# EAGLE design tm8_racingStripes (EAGLE 9.6.2)
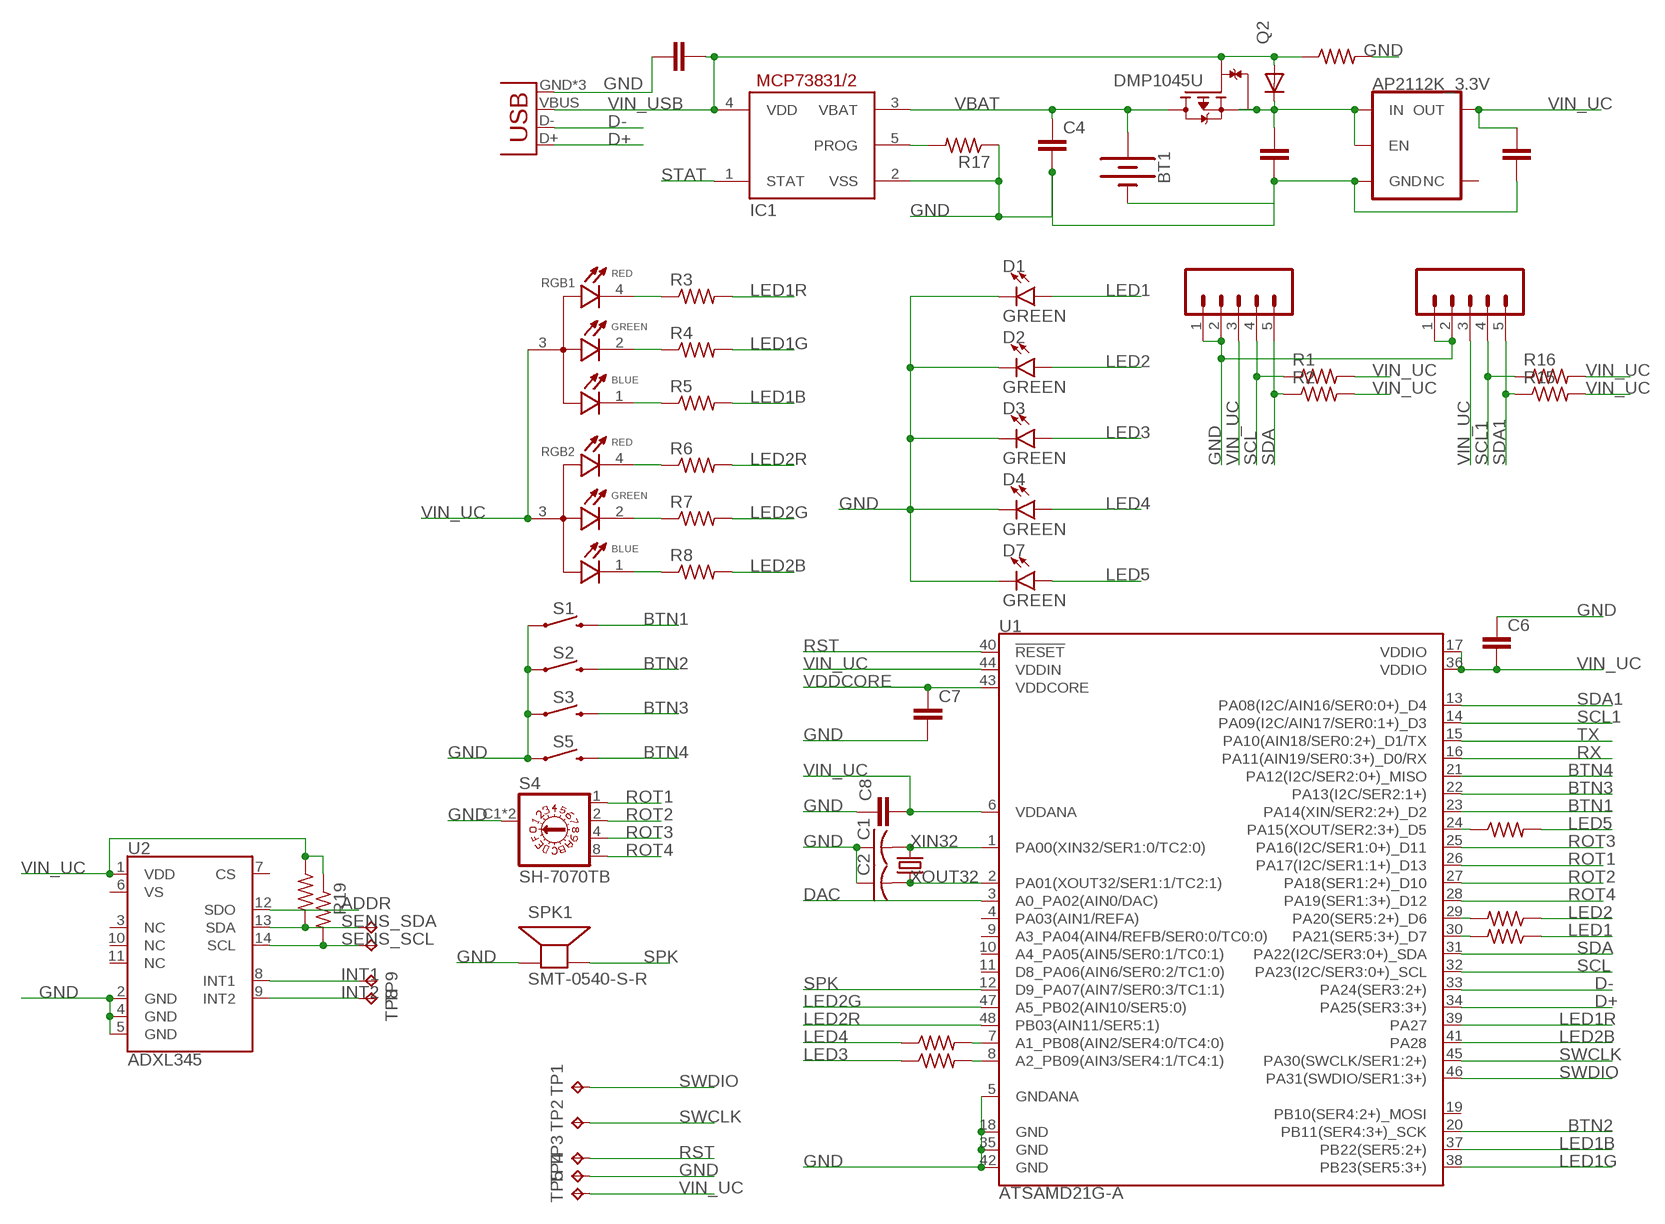
[diagram p0: schematic, sheet 1]

## Parts
AP2112K_3.3V  3.3V  V_REG_AP2112K-3.3V  [SOT23-5]
BT1  BATTERY-20MM_SMD_4LEGS_OVERPASTE_INNER  [BATTCON_20MM_4LEGS_OVERPASTE_INNER]
C1  C-USC0603  [C0603]
C2  C-USC0603  [C0603]
C3  C-EUC0603  [C0603]
C4  C-EUC0603  [C0603]
C5  C-EUC0603  [C0603]
C6  C-EUC0603  [C0603]
C7  C-EUC0603  [C0603]
C8  C-EUC0603  [C0603]
C9  C-EUC0603  [C0603]
D1  GREEN  LED-GREEN1206  [LED-1206]
D2  GREEN  LED-GREEN1206  [LED-1206]
D3  GREEN  LED-GREEN1206  [LED-1206]
D4  GREEN  LED-GREEN1206  [LED-1206]
D7  GREEN  LED-GREEN1206  [LED-1206]
D8  DIODESOD-323F  [SOD-323F]
IC1  MCP73831/OT  [SOT23-5L]
JP2  USB-MICROB  [USB-MICROB]
LCD1  CONN_05VERT_FEMALE_HEADER  [1X05_SMD_VERTICAL_COMBO]
LCD2  CONN_05VERT_FEMALE_HEADER  [1X05_SMD_VERTICAL_COMBO]
Q2  DMP1045U  [SOT91P240X110-3N]
R1  R-US_R0603  [R0603]
R2  R-US_R0603  [R0603]
R3  R-US_R0603  [R0603]
R4  R-US_R0603  [R0603]
R5  R-US_R0603  [R0603]
R6  R-US_R0603  [R0603]
R7  R-US_R0603  [R0603]
R8  R-US_R0603  [R0603]
R9  R-US_R0603  [R0603]
R10  R-US_R0603  [R0603]
R11  R-US_R0603  [R0603]
R12  R-US_R0603  [R0603]
R13  R-US_R0603  [R0603]
R14  R-US_R0603  [R0603]
R15  R-US_R0603  [R0603]
R16  R-US_R0603  [R0603]
R17  R-US_R0603  [R0603]
R18  R-US_R0603  [R0603]
R19  R-US_R0603  [R0603]
RGB1  EAST1616RGBA3  [LED_EAST1616RGBA3]
RGB2  EAST1616RGBA3  [LED_EAST1616RGBA3]
S1  MOMENTARY-SWITCH-SPST-SMD-6.0X3.5MM  [TACTILE_SWITCH_SMD_6.0X3.5MM]
S2  MOMENTARY-SWITCH-SPST-SMD-6.0X3.5MM  [TACTILE_SWITCH_SMD_6.0X3.5MM]
S3  MOMENTARY-SWITCH-SPST-SMD-6.0X3.5MM  [TACTILE_SWITCH_SMD_6.0X3.5MM]
S4  SH-7070TB  [SH-7070B]
S5  MOMENTARY-SWITCH-SPST-SMD-6.0X3.5MM  [TACTILE_SWITCH_SMD_6.0X3.5MM]
SPK1  SMT-0540-S-R  [SMT-0540-S-R]
TP1  TPTP10R  [TP10R]
TP2  TPTP10R  [TP10R]
TP3  TPTP10R  [TP10R]
TP4  TPTP10R  [TP10R]
TP5  TPTP10R  [TP10R]
TP6  TPTP10R  [TP10R]
TP7  TPTP10R  [TP10R]
TP8  TPTP10R  [TP10R]
TP9  TPTP10R  [TP10R]
U1  ATSAMD21G-A  [TQFP-48]
U2  ADXL345  [LGA-14]
Y1  32.768kHz  CRYSTAL-32.768KHZSMD-3.2X1.5  [CRYSTAL-SMD-3.2X1.5MM]

## Nets
ADDR: U2.12(SDO)
BTN1: S1.2 U1.23(PA14(XIN/SER2:2+)_D2)
BTN2: S2.2 U1.20(PB11(SER4:3+)_SCK)
BTN3: S3.2 U1.22(PA13(I2C/SER2:1+))
BTN4: S5.2 U1.21(PA12(I2C/SER2:0+)_MISO)
D+: JP2.D+ U1.34(PA25(SER3:3+))
D-: JP2.D- U1.33(PA24(SER3:2+))
DAC: U1.3(A0_PA02(AIN0/DAC))
GND: AP2112K_3.3V.2(GND) BT1.2(-) C1.1 C2.1 C3.1 C4.2 C5.2 C6.1 C7.2 C8.1 C9.2 D1.C D2.C D3.C D4.C D7.C IC1.2(VSS) JP2.GND JP2.MT1(GND) JP2.MT2(GND) LCD1.1 LCD1.2 LCD2.1 LCD2.2 R14.2 R17.1 S1.1 S2.1 S3.1 S4.C1(C) S4.C2(C) S5.1 SPK1.-(+) TP4.TP U1.5(GNDANA) U1.18(GND) U1.35(GND) U1.42(GND) U2.2(GND) U2.4(GND) U2.5(GND)
INT1: TP9.TP U2.8(INT1)
INT2: TP8.TP U2.9(INT2)
LED1: D1.A R9.1
LED1B: R5.2 U1.37(PB22(SER5:2+))
LED1G: R4.2 U1.38(PB23(SER5:3+))
LED1R: R3.2 U1.39(PA27)
LED2: D2.A R10.1
LED2B: R8.2 U1.41(PA28)
LED2G: R7.2 U1.47(A5_PB02(AIN10/SER5:0))
LED2R: R6.2 U1.48(PB03(AIN11/SER5:1))
LED3: D3.A R11.1
LED4: D4.A R12.1
LED5: D7.A R13.2
N$1: R12.2 U1.7(A1_PB08(AIN2/SER4:0/TC4:0))
N$2: R11.2 U1.8(A2_PB09(AIN3/SER4:1/TC4:1))
N$3: R9.2 U1.30(PA21(SER5:3+)_D7)
N$4: R10.2 U1.29(PA20(SER5:2+)_D6)
N$5: R3.1 RGB1.4(R_C)
N$6: R4.1 RGB1.2(G_C)
N$7: R5.1 RGB1.1(B_C)
N$8: R6.1 RGB2.4(R_C)
N$9: R7.1 RGB2.2(G_C)
N$10: R8.1 RGB2.1(B_C)
N$11: R13.1 U1.24(PA15(XOUT/SER2:3+)_D5)
N$13: IC1.5(PROG) R17.2
ROT1: S4.1 U1.26(PA17(I2C/SER1:1+)_D13)
ROT2: S4.2 U1.27(PA18(SER1:2+)_D10)
ROT3: S4.4 U1.25(PA16(I2C/SER1:0+)_D11)
ROT4: S4.8 U1.28(PA19(SER1:3+)_D12)
RST: TP3.TP U1.40(!RESET!)
RX: U1.16(PA11(AIN19/SER0:3+)_D0/RX)
SCL: LCD1.4 R1.1 U1.32(PA23(I2C/SER3:0+)_SCL)
SCL1: LCD2.4 R16.1 U1.14(PA09(I2C/AIN17/SER0:1+)_D3)
SDA: LCD1.5 R2.1 U1.31(PA22(I2C/SER3:0+)_SDA)
SDA1: LCD2.5 R15.1 U1.13(PA08(I2C/AIN16/SER0:0+)_D4)
SENS_SCL: R19.2 TP6.TP U2.14(SCL)
SENS_SDA: R18.2 TP7.TP U2.13(SDA)
SPK: SPK1.+(-) U1.12(D9_PA07(AIN7/SER0:3/TC1:1))
STAT: IC1.1(STAT)
SWCLK: TP2.TP U1.45(PA30(SWCLK/SER1:2+))
SWDIO: TP1.TP U1.46(PA31(SWDIO/SER1:3+))
TX: U1.15(PA10(AIN18/SER0:2+)_D1/TX)
VBAT: BT1.1(+) C4.1 IC1.3(VBAT) Q2.3(D)
VDDCORE: C7.1 U1.43(VDDCORE)
VIN_UC: AP2112K_3.3V.5(OUT) C5.1 C6.2 C8.2 LCD1.3 LCD2.3 R1.2 R2.2 R15.2 R16.2 R18.1 R19.1 RGB1.3(A) RGB2.3(A) TP5.TP U1.6(VDDANA) U1.17(VDDIO) U1.36(VDDIO) U1.44(VDDIN) U2.1(VDD)
VIN_UC_RAW: AP2112K_3.3V.1(IN) AP2112K_3.3V.3(EN) C9.1 D8.C Q2.2(S)
VIN_USB: C3.2 D8.A IC1.4(VDD) JP2.VBUS Q2.1(G) R14.1
XIN32: C1.2 U1.1(PA00(XIN32/SER1:0/TC2:0)) Y1.P$2
XOUT32: C2.2 U1.2(PA01(XOUT32/SER1:1/TC2:1)) Y1.P$1
Unconnected: AP2112K_3.3V.4(NC) U1.4(PA03(AIN1/REFA)) U1.9(A3_PA04(AIN4/REFB/SER0:0/TC0:0)) U1.10(A4_PA05(AIN5/SER0:1/TC0:1)) U1.11(D8_PA06(AIN6/SER0:2/TC1:0)) U1.19(PB10(SER4:2+)_MOSI) U2.3(NC) U2.6(VS) U2.7(CS) U2.10(NC) U2.11(NC)

## Library data of the parts
AP2112K_3.3V = SparkFun-IC-Power:V_REG_AP2112: AP2112 - 600mA CMOS LDO Regulator w/ Enable The AP2112 is CMOS process low dropout linear regulator with enable function, the regulator delivers a guaranteed 600mA (min.) continuous load current. Features Output Voltage Accuracy: ±1.5% Output Current: 600mA (Min.) Foldback Short Current Protection: 50mA Enable Function to Turn ON/OFF VOUT Low Dropout Voltage (3.3V): 250mV (Typ.) @IOUT=600mA Excellent Load Regulation: 0.2%/A (Typ.) Excellent Line Regulation: 0.02%/V (Typ.) Low Quiescent Current: 55μA (Typ.) Low Standby Current: 0.01μA (Typ.) Low Output Noise: 50μVRMS PSRR: 100Hz -65dB, 1kHz -65dB OTSD Protection Stable with 1.0μF Flexible Cap: Ceramic, Tantalum and Aluminum Electrolytic Operation Temperature Range: -40°C to 85°C ESD: MM 400V, HBM 4000V; PROD_ID: VREG-12457
BT1 = SparkFun-Batteries:BATTERY: Battery - Single Cell A variety of battery chemistries, sizes, and footprints. Device List: 20MM_PTH - Coin Cell Battery Holder - 20mm (PTH) <https://www.sparkfun.com/products/783> 20MM_PTH_KIT- Coin Cell battery Holder - 20 mm (PTH) <http://www.sparkfun.com/products/783>kit version with special mask 6.8MM_PTH - Coin Cell Battery Holder - 6.8MM(SMD) <https://www.digikey.com/product-detail/en/seiko-instruments/MS621FE-FL11E/728-1057-ND/1889208?WT.srch=1&gclid=CNOQ5a6LzdQCFZS2wAodXCkE0g> 12MM_SMD - Coin Cell Battery Holder - 12mm (SMD) <https://www.sparkfun.com/products/10592> 12MM_PTH - Coin Cell Battery Holder - 12mm (PTH) <https://www.sparkfun.com/products/7948> 20MM_SMD - 20mm Coin Cell Battery Holder (SMD) (2 legs) Used on the Big Time Watch Kit <https://www.sparkfun.com/products/11734> 20MM_SMD_4LEGS - Coin Cell Battery Holder - 20mm (SMD) <https://www.sparkfun.com/products/11892> 20MM_SMD_4LEGS_OVERPASTE - Coin Cell Battery Holder - 20mm (SMD) <https://www.sparkfun.com/products/11892> (Over-paste on the legs) 24.5MM_PTH - Coin Cell Battery Holder - 24.5mm (PTH) <https://www.sparkfun.com/products/8863> 9V - 9V Battery Holder - PC Mount Used on the SparkFun SparkPunk Sound Kit <https://www.sparkfun.com/products/11177> and SparkFun SparkPunk Sequencer Kit <https://www.sparkfun.com/products/12707> 18650 - Battery Holder - 18650 (PTH) <https://www.sparkfun.com/products/13113> AA - Battery Holder - 1xAA (PTH) <https://www.sparkfun.com/products/7949> AAA - Battery Holder - 1xAAA (PTH) <https://www.sparkfun.com/products/12718> AA_KIT - Battery Holder - 1xAA (PTH) <https://www.sparkfun.com/products/7949> Special kit package - pads only have exposed copper on one side of the board. AAA_KIT - Battery Holder - 1xAAA (PTH) <https://www.sparkfun.com/products/12718> Special kit package - pads only have exposed copper on one side of the board.
C1 C2 = adafruit:C-US: CAPACITOR, American symbol
C3-C9 = rcl:C-EU: CAPACITOR, European symbol; SPICEPREFIX: C
D1-D4 D7 = SparkFun-LED:LED-GREEN: Green SMD LED Used in manufacturing of various products at SparkFun Packages: 0603 - SMD 0603 package [Product Link] <http://www.futureelectronics.com/en/technologies/semiconductors/optoelectronics/leds/Pages/9894312-LTST-C190GKT.aspx?CrossPart=HSMG-C190&IM=0> LilyPad 1206 - SMD1206 LilyPad package [Product Link] <http://www.futureelectronics.com/en/Technologies/Product.aspx?ProductID=IN150NGHARVATEKCORPORATION2049943&IM=0> 1206 - SMD1206 package [Product Link] <http://www.futureelectronics.com/en/technologies/semiconductors/optoelectronics/leds/Pages/8315665-LTST-C150KGKT.aspx?IM=0> 1206 Bottom Mount -SMD 1206 Bottom Mount [Product Link] <http://www.digikey.com/product-detail/en/lite-on-inc/LTST-C230KGKT/160-1456-1-ND/386854> SparkFun Products: Pro Mini 328 -5V <https://www.sparkfun.com/products/821> RedBoard <https://www.sparkfun.com/products/12757> MP3 Trigger <https://www.sparkfun.com/products/13720> Makey Makey <https://www.sparkfun.com/products/11076>; PROD_ID: DIO-00862
D8 = adafruit:DIODE: Diode SMADIODE - SMA Surface Mount Package 20V 1A Schottky Diode Digikey: 641-1014-6-ND DO-1N4148 - Through Hole Small Current Diode SOD-123 20V 1 A (.5mV Vf) Schottky Diode - Digikey: MBRX120TPMSCT-ND SOD-323 10V 570mA (.38mV Vf, 3ns) Schottky Diode - Digikey: ZLLS410CT-ND SOD-523 30V 30mA Schottky Diode (RB751S-40TE61) - Digikey: RB751S-40TE61CT-ND SOT23-R/W - SOT23 Package (R = Solder Paste/Reflow Ovens, W = Hand-Soldering) BAT54Film 40V 300mA - Digikey: 497-7162-1-ND
IC1 = adafruit:MCP73831: MCP73831/2 Miniature Single-Cell, Fully Integrated Li-Ion, Li-Polymer Charge Management Controllers. Nice and small simple lipoly charge controller, with adjustable current and status output (LED) http://www.ladyada.net/library/pcb/eaglelibrary.html
JP2 = Feesta-parts:USB: USB Connectors USB-B-PTH is fully proven SKU : PRT-00139/CONN-08278 USB-miniB is fully proven SKU : PRT-00587 USB-A-PCB is untested. USB-A-H is throughly reviewed, but untested. Spark Fun Electronics SKU : PRT-00437 USB-B-SMT is throughly reviewed, but untested. Needs silkscreen touching up. USB-A-S has not been used/tested USB-MB-H has not been used/tested USB-MICROB has been used. CONN-09505; PROD_ID: CONN-09505
LCD1 LCD2 = SparkFun-Connectors:CONN_05: Multi connection point. Often used as Generic Header-pin footprint for 0.1 inch spaced/style header connections On any of the 0.1 inch spaced packages, you can populate with these: Break Away Headers - Straight <https://www.sparkfun.com/products/116> (PRT-00116) Break Away Male Headers - Right Angle <https://www.sparkfun.com/products/553> (PRT-00553) Female Headers <https://www.sparkfun.com/products/115> (PRT-00115) Break Away Headers - Machine Pin <https://www.sparkfun.com/products/117> (PRT-00117) Break Away Female Headers - Swiss Machine Pin <https://www.sparkfun.com/products/743> (PRT-00743) For SCREWTERMINALS and SPRING TERMINALS visit here: Screw Terimnals on SparkFun.com <https://www.sparkfun.com/search/results?term=Screw+Terminals> (5mm/3.5mm/2.54mm spacing) This device is also useful as a general connection point to wire up your design to another part of your project. Our various solder wires solder well into these plated through hole pads. Hook-Up Wire - Assortment (Stranded, 22 AWG) <https://www.sparkfun.com/products/11375> (PRT-11375) Hook-Up Wire - Assortment (Solid Core, 22 AWG) <https://www.sparkfun.com/products/11367> (PRT-11367) View the entire wire category on our website here <https://www.sparkfun.com/categories/141> Special notes: Molex polarized connector foot print use with SKU : PRT-08231 with associated crimp pins and housings. 1MM SMD Version SKU: PRT-10208; PROD_ID: CONN-15262
Q2 = DMP1045U:DMP1045U: P-Channel 12V 4A (Ta) 800mW (Ta) Surface Mount SOT-23 Check availability <https://pricing.snapeda.com/parts/DMP1045U/Diodes%20Inc./view-part?ref=eda>; AVAILABILITY: In Stock; DESCRIPTION: P-Channel 12 V 2.6A (Ta) 530mW Surface Mount X2-WLB0808-4 (Type C); MF: Diodes Inc.; MP: DMP1045U; PACKAGE: SOT-23 Diodes Inc.; PRICE: None; PURCHASE-URL: https://pricing.snapeda.com/search/part/DMP1045U/?ref=eda
R1-R13 R15 R16 R18 R19 = rcl:R-US_: RESISTOR, American symbol; SPICEPREFIX: R
R14 R17 = adafruit:R-US_: RESISTOR, American symbol
RGB1 RGB2 = EAST1616RGBA3:EAST1616RGBA3: Red, Green, Blue (RGB) LED Indication - Discrete 1.95V Red, 2.8V Green, 2.8V Blue 0606 (1616 Metric) Check availability <https://pricing.snapeda.com/parts/EAST1616RGBA3/Everlight%20Electronics/view-part?ref=eda>; AVAILABILITY: In Stock; DESCRIPTION: Red, Green, Blue (RGB) - LED Indication - Discrete 1.95V Red, 2.8V Green, 2.8V Blue 0606 (1616 Metric); MF: Everlight Electronics; MP: EAST1616RGBA3; PACKAGE: 0606 Everlight; PRICE: None; PURCHASE-URL: https://pricing.snapeda.com/search/part/EAST1616RGBA3/?ref=eda
S1-S3 S5 = SparkFun-Switches:MOMENTARY-SWITCH-SPST: Momentary Switch (Pushbutton) - SPST Normally-open (NO) SPST momentary switches (buttons, pushbuttons). Variants PTH-12MM - 12mm square, through-hole Momentary Pushbutton Switch - 12mm Square <https://www.sparkfun.com/products/9190> (COM-09190) PTH-6.0MM, PTH-6.0MM-KIT - 6.0mm square, through-hole Mini Pushbutton Switch <https://www.sparkfun.com/products/97> (COM-00097) KIT package intended for soldering kit's - only one side of pads' copper is exposed. PTH-RIGHT-ANGLE-KIT - Right-angle, through-hole Right Angle Tactile Button <https://www.sparkfun.com/products/10791> - Used on SparkFun BigTime Watch Kit <https://www.sparkfun.com/products/11734> SMD-12MM - 12mm square, surface-mount Tactile Button - SMD (12mm) <https://www.sparkfun.com/products/12993> (COM-12993) Used on SparkFun PicoBoard <https://www.sparkfun.com/products/11888> SMD-4.5MM - 4.5mm Square Trackball Switch Used on SparkFun Blackberry Trackballer Breakout <https://www.sparkfun.com/products/13169> SMD-4.6MMX2.8MM - 4.60mm x 2.80mm, surface mount Used on SparkFun Pro Micro - RP2040 <https://www.sparkfun.com/products/17717> SMD-5.2MM, SMD-5.2-REDUNDANT - 5.2mm square, surface-mount Mini Pushbutton Switch - SMD <https://www.sparkfun.com/products/8720> (COM-08720) Used on Arduino Pro Mini <https://www.sparkfun.com/products/11114> REDUNDANT package connects both switch circuits together SMD-6.0X3.5MM - 6.0 x 3.5mm, surface mount Momentary Reset Switch SMD <https://www.sparkfun.com/products/8229> (COM-08229) SMD-6.2MM-TALL - 6.2mm square, surface mount Tactile Button - SMD (6mm) <https://www.sparkfun.com/products/12992> Used on SparkFun Digital Sandbox <https://www.sparkfun.com/products/12651> SMD-RIGHT-ANGLE - Right-angle, surface mount Used on SparkFun Block for Intel® Edison - Arduino <https://www.sparkfun.com/products/13036>; PROD_ID: SWCH-14278; SF_SKU: COM-08229
S4 = SH-7070TB:SH-7070TB: ROTARY CODED HEX SWITCH Check availability <https://pricing.snapeda.com/parts/SH-7070TB/Nidec%20Copal/view-part?ref=eda>; AVAILABILITY: In Stock; DESCRIPTION: Dip Switch Hexadecimal Complement 16 Position Surface Mount Rotary for Tool Actuator 100mA 5VDC; MF: Nidec Copal; MP: SH-7070TB; PACKAGE: None; PRICE: None; PURCHASE-URL: https://pricing.snapeda.com/search/part/SH-7070TB/?ref=eda
SPK1 = SMT-0540-S-R:SMT-0540-S-R: SMT-0549-S-R Small surface-mount magnetic buzzer Check availability <https://pricing.snapeda.com/parts/SMT-0540-S-R/PUI/view-part?ref=eda>; AVAILABILITY: In Stock; DESCRIPTION: SURFACE MOUNT TRANSDUCER 3V0-P 100MA; MF: PUI; MP: SMT-0540-S-R; PACKAGE: None; PRICE: None; PURCHASE-URL: https://pricing.snapeda.com/search/part/SMT-0540-S-R/?ref=eda
TP1-TP9 = testpad:TP: Test pad
U1 = SparkFun-IC-Microcontroller:ATSAMD21G: Atmel SAMD21G SMART ARM-Based Microcontroller The Atmel ® | SMART ™ SAM D21 is a series of low-power microcontrollers using the 32-bit ARM ® Cortex ® -M0+ processor, and ranging from 32- to 64-pins with up to 256KB Flash and 32KB of SRAM. The SAM D21 devices operate at a maximum frequency of 48MHz and reach 2.46 CoreMark/MHz. They are designed for simple and intuitive migration with identical peripheral modules, hex compatible code, identical linear address map and pin compatible migration paths between all devices in the product series. All devices include intelligent and flexible peripherals, Atmel Event System for inter-peripheral signaling, and support for capacitive touch button, slider and wheel user interfaces. Datasheet <https://cdn.sparkfun.com/datasheets/Dev/Arduino/Boards/Atmel-42181-SAM-D21_Datasheet.pdf> SparkFun Products SparkFun SAMD21 Mini Breakout <https://www.sparkfun.com/products/13664> (DEV-13664) SparkFun SAMD21 Dev Breakout <https://www.sparkfun.com/products/13672> (DEV-13672) (DEV-14926); PROD_ID: IC-13064
U2 = SparkFun-Sensors:ADXL345: Analog Devices ADXL345 3-Axis SPI/I2C 2/4/8/16g Accelerometer The ADXL345 is a small, thin, low power, 3-axis accelerometer with high resolution (13-bit) measurement at up to ±16g. Digital output data is formatted as 16-bit twos complement and is accessible through either a SPI (3- or 4-wire) or I2C digital interface. Datasheet <https://www.sparkfun.com/datasheets/Sensors/Accelerometer/ADXL345.pdf> SparkFun Products SparkFun Triple Axis Accelerometer Breakout - ADXL345 <https://www.sparkfun.com/products/9836> (SEN-09836) Triple Axis Accelerometer - ADXL345 <https://www.sparkfun.com/products/9045> (SEN-09045) SparkFun 6 Degrees of Freedom IMU Digital Combo Board - ITG3200/ADXL345 <https://www.sparkfun.com/products/10121> (SEN-10121); PROD_ID: IC-09097; SF_ID: SEN-09045
Y1 = SparkFun-Clocks:CRYSTAL-32.768KHZ: 32.768kHz Crystal Frequency: 32.768kHz Frequency Stability: ±20ppm Load Capacitance: 12.5pF (PTH-2X6 & SMD-3.2X1.5), 6pF (SMD-2X6) SparkFun Products: SparkFun BigTime Watch Kit <https://www.sparkfun.com/products/11734> SparkFun nRF52832 Breakout <https://www.sparkfun.com/products/13990> SparkFun Real Time Clock Module <https://www.sparkfun.com/products/12708>; PROD_ID: XTAL-13062

## Board
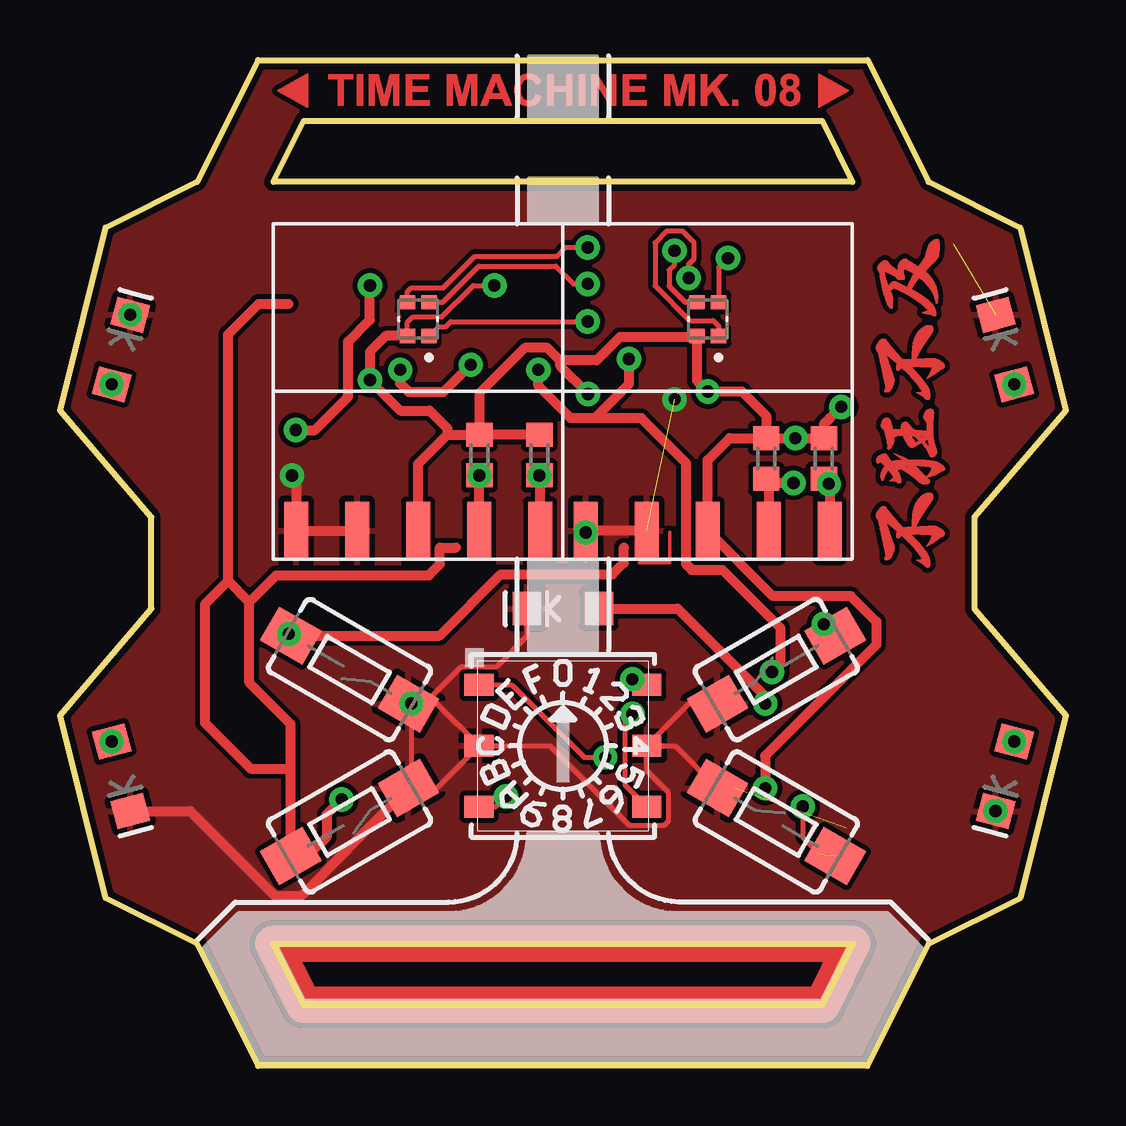
[diagram p1: board, top side]
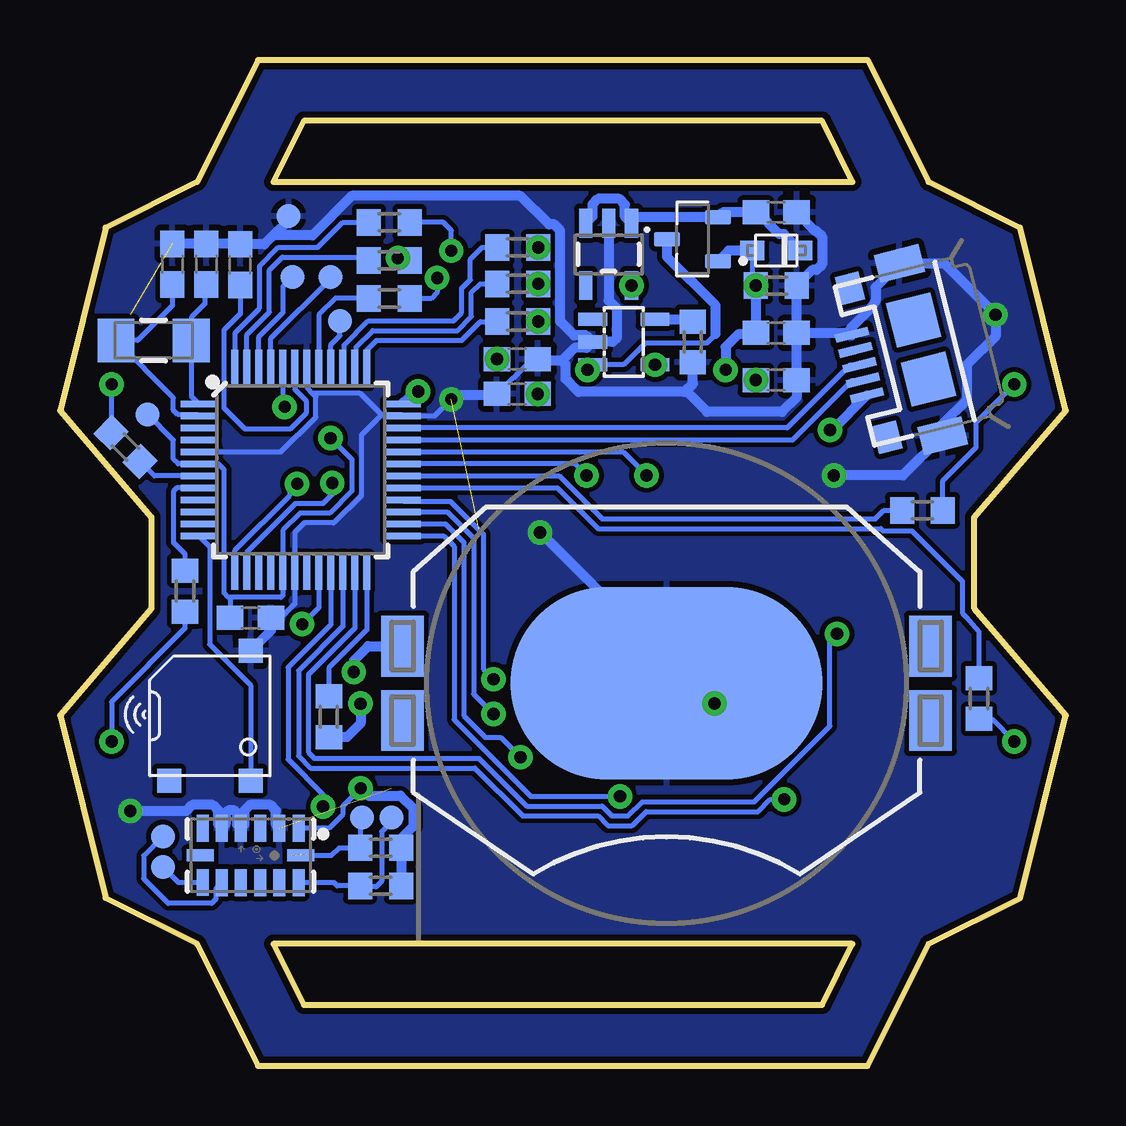
[diagram p2: board, bottom side, seen from below]

Size 41.91 x 41.91 mm. Coordinates in mm from the lower left corner, seen from the top.
Outline: 33.66,0 8.25,0 5.71,5.08 1.9,6.99 0,14.6 3.81,19.05 3.81,22.86 0,27.3 1.9,34.92 5.71,36.83 8.25,41.91 33.66,41.91 36.2,36.83 40,34.92 41.91,27.3 38.1,22.86 38.1,19.05 41.91,14.6 40,6.99 36.2,5.08 33.66,0
Outline: 8.89,36.83 10.16,39.37 31.75,39.37 33.02,36.83 8.89,36.83
Outline: 33.02,5.08 31.75,2.54 10.16,2.54 8.89,5.08 33.02,5.08
Copper layers (1*16): Top 0.035mm / dielectric 1.5mm / Bottom 0.035mm
Design rules "SparkFun": minimum track width 8mil, minimum drill 20mil, track to track 8mil, track to pad 8mil, pad to pad 8mil, via to via 8mil, smd to smd 8mil, copper to edge 10mil, drill to drill 8mil, minimum pad ring 12mil, minimum via ring 10mil, stop-mask expansion 4mil, vias tented up to drill 25mil, thermal gap 10mil

### Footprints (pad centres in the part's own frame; a part is rotated, then mirrored left to right if it is on the bottom)
SOT23-5 = smd 0.55 x 1.2: 1 -0.95,-1.3; 2 0,-1.3; 3 0.95,-1.3; 4 0.95,1.3; 5 -0.95,1.3
BATTCON_20MM_4LEGS_OVERPASTE_INNER = smd 1.778 x 2.54: 1 -11,1.55; 3 11,1.55; P$1 -11,-1.55; P$2 11,-1.55 | smd 13 x 8: 2 0,0
C0603 = smd 1.1 x 1: 1 -0.85,0; 2 0.85,0
LED-1206 = smd 1.2 x 1.4: A -1.5,0; C 1.5,0
SOD-323F = smd 1 x 0.8: A -1,0; C 1,0
SOT23-5L = smd 0.55 x 1.2: 1 -0.95,-1.3; 2 0,-1.3; 3 0.95,-1.3; 4 0.95,1.3; 5 -0.95,1.3
USB-MICROB = smd 0.35 x 1.4: D+ 0,2.65; D- -0.65,2.65; GND 1.3,2.65; ID 0.65,2.65; VBUS -1.3,2.65 | smd 1.2 x 1.9: MT1 -3.7,0; MT2 3.7,0 | smd 1.9 x 1.9: P$1 -1.27,0; P$2 1.27,0 | smd 1.2 x 1: P$3 -3.2,2.25; P$4 3.2,2.25
1X05_SMD_VERTICAL_COMBO = smd 1 x 2.438: 1 0,1.65; 2 2.54,1.65; 3 5.08,1.65; 4 7.62,1.652; 5 10.16,1.65
SOT91P240X110-3N = smd 1.09 x 0.61: 1 -1.07,0.915; 2 -1.07,-0.915; 3 1.07,0
R0603 = smd 1 x 1.1: 1 -0.85,0; 2 0.85,0
LED_EAST1616RGBA3 = smd 0.6 x 0.65: 1 0.7,0.45; 2 -0.7,0.45; 3 0.7,-0.45; 4 -0.7,-0.45
TACTILE_SWITCH_SMD_6.0X3.5MM = smd 2.032 x 1.626: 1 -2.833,0; 2 2.833,0
SH-7070B = smd 1.219 x 0.914: 1 -2.223,3.81; 2 4.763,-1.27; 4 -2.223,-1.27; 8 4.763,3.81; C1 -2.223,1.27; C2 4.763,1.27
SMT-0540-S-R = smd 1 x 1: + 1.7,-2.7; - 1.7,2.7; M -1.7,-2.7
TP10R = smd 1 x 1: TP 0,0
TQFP-48 = smd 1.5 x 0.28: 1 -4.25,2.75; 2 -4.25,2.25; 3 -4.25,1.75; 4 -4.25,1.25; 5 -4.25,0.75; 6 -4.25,0.25; 7 -4.25,-0.25; 8 -4.25,-0.75; 9 -4.25,-1.25; 10 -4.25,-1.75; 11 -4.25,-2.25; 12 -4.25,-2.75; 25 4.25,-2.75; 26 4.25,-2.25; 27 4.25,-1.75; 28 4.25,-1.25; 29 4.25,-0.75; 30 4.25,-0.25; 31 4.25,0.25; 32 4.25,0.75; 33 4.25,1.25; 34 4.25,1.75; 35 4.25,2.25; 36 4.25,2.75 | smd 0.28 x 1.5: 13 -2.75,-4.25; 14 -2.25,-4.25; 15 -1.75,-4.25; 16 -1.25,-4.25; 17 -0.75,-4.25; 18 -0.25,-4.25; 19 0.25,-4.25; 20 0.75,-4.25; 21 1.25,-4.25; 22 1.75,-4.25; 23 2.25,-4.25; 24 2.75,-4.25; 37 2.75,4.25; 38 2.25,4.25; 39 1.75,4.25; 40 1.25,4.25; 41 0.75,4.25; 42 0.25,4.25; 43 -0.25,4.25; 44 -0.75,4.25; 45 -1.25,4.25; 46 -1.75,4.25; 47 -2.25,4.25; 48 -2.75,4.25
LGA-14 = smd 0.5 x 1.124: 1 2,1.138; 2 1.2,1.138; 3 0.4,1.138; 4 -0.4,1.138; 5 -1.2,1.138; 6 -2,1.138; 8 -2,-1.13; 9 -1.2,-1.138; 10 -0.4,-1.138; 11 0.4,-1.138; 12 1.2,-1.138; 13 2,-1.138 | smd 1.124 x 0.5: 7 -2.1,0; 14 2.1,0
CRYSTAL-SMD-3.2X1.5MM = smd 1.524 x 1.8: P$1 -1.567,0; P$2 1.567,0

### Placement (x,y rotation side)
AP2112K_3.3V  19.05,33.81 180 bottom
BT1  16.64,15.94 0 bottom
C1  35.81,33.4 270 bottom
C2  37.22,33.4 270 bottom
C3  12.06,30.54 180 bottom
C4  22.85,29.45 0 bottom
C5  12.06,28.57 0 bottom
C6  22.85,27.99 0 bottom
C7  34.4,33.38 90 bottom
C8  33.97,18.67 180 bottom
C9  12.06,35.56 0 bottom
D1  2.54,29.84 75 top
D2  2.54,12.06 285 top
D3  39.37,12.06 255 top
D4  39.37,29.84 105 top
D7  20.95,19.05 180 top
D8  12.06,33.97 0 bottom
IC1  18.41,30.16 270 bottom
JP2  6.03,29.84 104.1 bottom
LCD1  9.84,20.64 0 top
LCD2  21.91,20.64 0 top
Q2  15.56,34.45 180 bottom
R1  17.47,25.45 90 top
R2  19.97,25.45 90 top
R3  22.83,34.1 180 bottom
R4  22.83,32.58 180 bottom
R5  22.83,31.01 180 bottom
R6  28.19,35.15 180 bottom
R7  28.19,33.56 180 bottom
R8  28.19,31.97 180 bottom
R9  5.98,23.14 180 bottom
R10  3.62,15.3 90 bottom
R11  36.7,19.78 90 bottom
R12  39.18,25.78 315 bottom
R13  30.71,14.54 270 bottom
R14  12.06,32.51 0 bottom
R15  31.83,25.3 90 top
R16  29.43,25.3 90 top
R17  15.54,30.16 90 bottom
R18  28.55,7.5 180 bottom
R19  28.55,9.09 180 bottom
RGB1  14.92,31.11 270 top
RGB2  26.99,31.11 270 top
S1  12.06,16.51 150 top
S2  29.84,16.51 30 top
S3  12.06,10.16 210 top
S4  19.68,12.06 0 top
S5  29.84,10.16 330 top
SPK1  35.67,14.59 0 bottom
TP1  32.23,32.86 90 bottom
TP2  30.64,32.86 180 bottom
TP3  30.25,31.03 180 bottom
TP4  32.38,35.4 0 bottom
TP5  38.26,27.15 0 bottom
TP6  29.33,10.36 0 bottom
TP7  28.1,10.36 0 bottom
TP8  37.62,9.56 0 bottom
TP9  37.62,8.29 0 bottom
U1  31.88,24.83 0 bottom
U2  33.97,8.77 0 bottom
Y1  38.01,30.23 0 bottom

### Tracks (layer width: path | path; a pad name or v marks a point on that pad's centre or on a via)
BTN1  (via drill 0.51)
  Top 0.203: v9.54,18 S1.2
  Top 0.406: S1.2 15.82,17.93 18.37,20.47 23.01,20.47 23.49,20.95 23.49,21.59
  Bottom 0.203: U1.23 29.63,18.24 31.56,16.3 31.56,13.07 31.31,12.81 29.57,12.81 24.46,12.81 22.46,10.82 19.32,10.82 18.92,10.41 18.24,10.41 17.66,11 12.99,11 9.83,14.15 9.83,17.71 v9.54,18
BTN2  (via drill 0.51)
  Top 0.203: S2.2 v31.82,18.4
  Bottom 0.203: U1.20 31.13,19.1 v31.82,18.4
BTN3  (via drill 0.51)
  Top 0.203: 10.32,8.89 9.84,8.89 9.61,8.89
  Top 0.406: 10.18,8.74 S3.2 9.61,8.89 9.61,12.38 | 7.89,19.32 9,20.44 15.37,20.44 15.83,20.9 15.83,21.59 16.51,21.59 | 7.89,19.32 7.01,20.2 | 7.01,20.2 7.01,30.48 8.28,31.75 9.52,31.75 | 9.61,12.38 9.61,14.24 7.89,15.96 7.89,19.32 | 7.01,20.2 6.03,19.23 6.03,14.29 7.94,12.38 9.61,12.38 | v11.74,11.1 11.11,10.48 11.11,9.53 10.48,8.89 9.84,8.89
  Bottom 0.203: U1.22 30.13,18.31 31.97,16.47 31.97,12.9 31.48,12.41 24.63,12.41 22.63,10.41 19.49,10.41 19.09,10.01 18.07,10.01 17.49,10.59 12.82,10.59 12.31,11.1 v11.74,11.1
BTN4  (via drill 0.51)  (1 unrouted)
  Top 0.203: 31.66,8.82 30.95,9.53 v30.95,10.8
  Bottom 0.203: U1.21 30.63,18.38 32.41,16.6 32.41,12.77 30.95,11.3 v30.95,10.8
D+
  Bottom 0.203: U1.34 11.62,26.58 9,29.2 JP2.D+
D-
  Bottom 0.203: U1.33 11.39,26.08 8.91,28.56 8.67,28.56 8.66,28.57 JP2.D-
GND  (via drill 0.51)  (3 unrouted)
  Top 0.203: 21.91,21.5 v21.91,22.23 | 19.52,19.11 D7.C 19.45,17.89 18.2,16.64 16.73,16.64 15.18,15.09 v14.64,15.09 | S4.C2 25.63,13.33 S5.1 28.1,11.58 | v14.64,15.09 S1.1 14.64,14.97 14.64,11.58 | S4.C1 15.7,11.58 14.64,11.58 | 14.64,11.58 S3.1 | S4.C2 26.21,15.09 S2.1 | S4.C1 15.7,15.09 v14.64,15.09 | S4.C2 24.45,12.29 25.36,11.38 25.36,10.21 25.18,10.03 23.71,10.03 20.41,13.33 S4.C1
  Top 0.406: v9.66,24.6 9.84,24.42 LCD1.1 LCD1.2 | LCD2.2 LCD2.1 v21.91,22.23 | D2.C 5.44,10.62 8.96,7.1 10.06,7.1 11.95,8.98 11.95,9.01 S3.1
  Bottom 0.203: v25.61,27.77 26.3,27.08 U1.35 27.68,27.13 28.5,27.13 | BT1.2 16.22,15.53 15.79,15.09 v14.64,15.09 | 15.97,29 15.55,29 R17.1 | 28.5,27.13 29.39,28.02 31.39,28.02 | 31.39,28.02 31.57,28.2 31.57,29.02 U1.42 | 28.5,27.13 29.35,26.29 29.35,23.78 30.5,22.62 31.74,22.62 32.13,22.24 U1.18 32.13,19.25 32.7,18.67 C8.1 | 31.39,28.02 31.25,27.88 31.25,27.03 32.7,25.58 U1.5 | C6.1 23.05,28.65 23.03,28.65 22.22,29.45 C4.2
  Bottom 0.406: C3.1 C5.2 11.21,27.86 11.83,27.24 14.95,27.24 15.78,28.08 15.89,28.08 | C3.1 R14.2 10.56,33.17 10.4,33.17 10.16,33.4 10.16,34.54 10.4,34.78 10.43,34.78 C9.2 | 19.67,30.11 IC1.2 | AP2112K_3.3V.2 19.05,31.9 18.71,31.56 18.71,30.34 18.89,30.16 IC1.2 | IC1.2 19.97,29.91 20.46,29.91 21,29.38 | 21,29.38 20.85,29.23 20.85,28.62 20.31,28.08 15.89,28.08 | IC1.2 19.98,30.43 20.48,30.43 21.07,31.02 21.07,34.81 21.32,35.06 21.53,35.06 22.72,36.25 29.74,36.25 31.38,34.61 33.02,34.61 | C3.1 9,30.54 | 9,30.54 JP2.GND | 9,30.54 9,30.68 8.1,31.59 7.93,31.88 7.93,32.44 JP2.MT2 5.07,33.43 D1.C 2.93,30.41 4.13,29.2 4.13,27.74 5.13,26.75 JP2.MT1 6.79,24.6 v9.66,24.6 | 33.02,34.61 33.4,34.23 C7.2 34.42,34.25 C1.1 C2.1 | 15.89,28.08 15.55,28.43 15.55,29 | 21,29.38 21.93,29.38 C4.2 | C6.1 23.76,27.94 25.44,27.94 v25.61,27.77 | 33.22,18.67 C8.1 33.12,18.13 SPK1.- | v21.91,22.23 16.22,16.54 16.22,15.53 | TP4.TP 32.38,35.24 33.02,34.61 | U2.2 32.92,10.05 32.92,10.64 33.15,10.88 33.99,10.88 34.23,10.64 34.23,10.05 U2.4 34.53,10.07 34.53,10.53 34.65,10.65 34.89,10.65 35.01,10.53 35.01,10.07 U2.5 35.32,10.05 35.32,10.64 35.55,10.88 36.39,10.88 36.65,10.62 D3.C
  other vias: 2.93,31.29 38.98,10.62
  pour Bottom: -1.27,43.18 -1.27,-1.75 43.33,-1.75 43.33,43.18
  pour Top: -1.27,43.18 -1.27,-1.75 43.33,-1.75 43.33,43.18
INT1
  Bottom 0.203: U2.8 36.97,7.64 TP9.TP
INT2
  Bottom 0.203: U2.9 35.42,7.39 35.42,6.95 35.6,6.77 37.4,6.77 38.43,7.8 38.43,8.76 TP8.TP
LED1  (via drill 0.51)
  Bottom 0.203: R9.1 5.12,24.38 3.74,25.77 3.74,26.81 D1.A
  other vias: 2.15,28.4
LED1B
  Bottom 0.203: U1.37 29.13,29.82 28.72,30.23 25.17,30.23 24.39,31.01 R5.2
LED1G
  Bottom 0.203: U1.38 29.57,29.13 29.57,29.95 28.89,30.64 25.34,30.64 24.77,31.21 24.77,32.23 24.41,32.58 R4.2
LED1R
  Bottom 0.203: U1.39 30.07,29.13 30.07,30.03 29.06,31.04 25.51,31.04 25.17,31.38 25.17,32.39 24.81,32.75 24.81,33.61 24.32,34.1 R3.2
LED2  (via drill 0.51)
  Bottom 0.203: R10.1 3.09,14.45 D2.A
  other vias: 2.15,13.51
LED2B
  Bottom 0.203: R8.2 29.06,31.99 30.43,31.99 31.13,31.29 U1.41
LED2G
  Bottom 0.203: 29.15,33.67 R7.2 29.18,33.69 32.64,33.69 33.19,33.15 33.19,31.4 34.13,30.46 U1.47
LED2R
  Bottom 0.203: U1.48 34.61,29.1 34.61,30.55 33.59,31.57 33.59,33.32 32.81,34.1 31.17,34.1 30.12,35.15 R6.2
LED3  (via drill 0.51)
  Bottom 0.203: R11.1 36.7,18.23 39.76,15.17 D3.A
  other vias: 39.76,13.51
LED4  (via drill 0.51)
  Bottom 0.203: R12.1 39.76,26.4 D4.A
  other vias: 39.76,28.4
LED5  (via drill 0.51)
  Top 0.406: D7.A 25.74,19.05 29.39,15.4 v29.39,15.09
  Bottom 0.406: v29.39,15.09 29.39,14.27 29.96,13.69 R13.2
N$1
  Bottom 0.203: U1.7 37.98,24.58 R12.2
N$2
  Bottom 0.203: U1.8 37.04,24.08 37.18,23.94 37.18,21.81 36.7,21.33 R11.2
N$3
  Bottom 0.203: 6.84,23.15 R9.2 7.59,23.14 7.94,22.79 19.32,22.79 21.11,24.58 U1.30
N$4
  Bottom 0.203: R10.2 3.62,18.09 4.16,18.72 4.31,18.86 4.31,20.18 6.41,22.29 7.61,22.29 7.71,22.38 19.49,22.38 21.18,24.08 U1.29
N$5  (via drill 0.51)
  Top 0.203: RGB1.4 14.47,32.25 14.64,32.42 15.97,32.42 17.28,33.73 20.71,33.73 21.08,34.1 R3.1
  other vias: 21.98,34.1
N$6  (via drill 0.51)
  Top 0.203: R4.1 21.4,32.58 20.66,33.33 17.45,33.33 15.94,31.81 RGB1.2
  other vias: 21.98,32.58
N$7  (via drill 0.51)
  Top 0.203: RGB1.1 15.76,30.8 16.08,30.8 16.29,31.01 R5.1
  other vias: 21.98,31.01
N$8  (via drill 0.51)
  Top 0.203: v25.61,33.96 25.61,33.39 25.38,33.16 25.38,32.49 26.05,31.81 RGB2.4
  Bottom 0.203: v25.61,33.96 25.61,34.81 25.94,35.15 R6.1
N$9  (via drill 0.51)
  Top 0.203: v27.83,33.66 27.44,33.26 RGB2.2
  Bottom 0.203: v27.83,33.66 27.74,33.56 R7.1
N$10  (via drill 0.51)
  Top 0.203: v26.19,32.83 26.19,33.4 26.42,33.63 26.42,34.3 25.94,34.78 25.27,34.78 24.79,34.3 24.79,32.5 26.24,31.05 27.21,31.05 27.44,30.82 RGB2.1
  Bottom 0.203: v26.19,32.83 26.19,32.23 26.45,31.97 R8.1
N$11
  Bottom 0.203: U1.24 29.13,18.16 30.71,16.58 R13.1
N$12
  Top 1.524: 8.89,5.08 33.02,5.08 31.75,2.54 10.16,2.54 8.89,5.08
N$13
  Bottom 0.203: IC1.5 17.02,31.01
  Bottom 0.406: IC1.5 15.64,31.11 R17.2
N$14
  Top 0.152: 24.13,20.95 25.4,20.95 25.4,22.23
ROT1  (via drill 0.51)
  Top 0.203: S4.1 18.81,15.87 21.84,12.85 v22.71,12.85 v22.72,12.86
  Bottom 0.203: v22.72,12.86 23.55,13.69 24.18,13.69 25.08,14.59 25.08,21.81 25.85,22.58 U1.26
ROT2  (via drill 0.51)
  Top 0.203: v23.85,14.66 23.53,14.35 23.53,11.71 S4.2
  Bottom 0.203: v23.85,14.66 24.68,15.49 24.68,21.98 25.78,23.08 U1.27
ROT3  (via drill 0.51)
  Top 0.203: v18.58,11.23 18.15,10.79 S4.4
  Bottom 0.203: v18.58,11.23 22.3,11.23 24.98,13.91 | 24.98,13.91 25.49,14.42 25.49,21.64 25.93,22.08 U1.25 | 24.98,13.91
ROT4  (via drill 0.51)
  Top 0.203: v23.85,16.11 24.08,15.87 S4.8
  Bottom 0.203: U1.28 27.57,23.52 25.65,23.52 24.27,22.15 24.27,16.53 v23.85,16.11
RST
  Bottom 0.203: U1.40 30.63,30.05 30.25,30.42 TP3.TP
SCL  (via drill 0.51)
  Top 0.406: LCD1.4 R1.1
  Bottom 0.203: U1.32 18.45,25.58 R1.1
  other vias: 17.47,24.6
SCL1  (via drill 0.51)
  Top 0.406: LCD2.4 29.53,24.35 R16.1 29.59,24.29 v30.56,24.29
  Bottom 0.203: U1.14 34.13,21.4 32.09,23.44 30.94,23.44 30.56,23.81 v30.56,24.29
SDA  (via drill 0.51)
  Top 0.406: LCD1.5 20,24.57 R2.1
  Bottom 0.203: R2.1 20.45,25.08 U1.31
  other vias: 19.97,24.6
SDA1  (via drill 0.51)
  Top 0.203: 32.07,24.21 v32.03,24.25 R15.1
  Top 0.406: R15.1 32.07,24.21 LCD2.5
  Bottom 0.203: U1.13 34.63,21.47 32.35,23.75 32.35,23.93 v32.03,24.25
SENS_SCL
  Bottom 0.203: 29.4,10.29 TP6.TP 29.4,10.29 | U2.14 30.6,8.77 30.28,9.09 R19.2 29.4,10.29
SENS_SDA
  Bottom 0.203: TP7.TP 28.26,10.2 28.26,10.01 28.5,9.76 28.5,7.69 28.73,7.46 29.36,7.46 R18.2 30.36,7.5 30.49,7.63 U2.13
SPK
  Bottom 0.203: SPK1.+ 33.97,15.85 35.68,17.56 35.68,21.63 U1.12
SWCLK
  Bottom 0.203: U1.45 33.13,30.31 30.64,32.8 TP2.TP
SWDIO
  Bottom 0.203: U1.46 33.63,30.38 32.62,31.39 32.62,32.46 TP1.TP
VBAT  (via drill 0.51)
  Top 0.406: C4.1 23.7,28.4 22.29,26.99 | 22.29,26.99 21.27,26.99 19.93,28.33 v19.93,29 | v29.67,16.41 29.99,16.73 30,16.73 30,18.26 27.6,20.66 26.32,20.66 26.08,20.9 26.08,25.13 24.22,26.99 22.29,26.99
  Bottom 0.203: v19.93,29 19.93,29.12 19.84,29.21 IC1.3 18.42,29.21 17.52,30.12 14.96,30.12 14.59,30.49
  Bottom 0.406: Q2.3 16.63,33.72 14.59,31.68 14.59,30.49 | v29.67,16.41 29.67,16.89 29.07,17.49 BT1.1
  other vias: 23.7,29.45
VDDCORE
  Bottom 0.203: C7.1 34.4,31.34 35.07,30.66 35.07,27.41 34.2,26.53 32.32,26.53 31.66,27.2 31.66,27.71 32.13,28.18 U1.43
VIN_UC  (via drill 0.51)
  Top 0.203: 26.37,30.24 RGB2.3 26.31,30.41 26.16,30.26 | RGB1.3 14.47,30.98 14.7,31.21 15.91,31.21 17.21,32.51 AP2112K_3.3V.5
  Top 0.406: R2.2 R1.2 | 16.14,26.3 R1.2 | LCD1.3 14.92,25.08 16.14,26.3 | C6.2 20.85,29.15 20.85,29.38 20.82,29.4 | 20.82,29.4 20.31,29.91 19.37,29.91 17.47,28.02 R1.2 | 20.82,29.4 22.36,29.4 23.32,30.37 26.49,30.37 RGB2.3 26.54,28.55 v26.99,28.1 28.42,28.1 29.43,27.09 R16.2 | R16.2 v30.64,26.16 R15.2 31.83,26.75 32.07,26.99 32.08,26.99 v32.55,27.46 | R16.2 27.9,26.16 26.99,25.24 LCD2.3 29.7,19.57 32.95,19.57 34.02,18.51 34.02,17.55 29.38,12.91 v29.38,11.57 | RGB1.3 13.58,30.41 12.91,29.75 C5.1 14.18,27.3 15.4,27.3 16.14,26.56 16.14,26.3
  Bottom 0.203: U1.44 32.63,27.53 v32.55,27.46 | U1.36 27.56,27.64 | v30.64,26.16 29.75,25.27 29.75,23.95 30.67,23.03 31.91,23.03 32.63,22.31 U1.17 32.63,19.6 32.7,19.52 34.82,19.52 | 34.82,19.52 C8.2 | 34.82,19.52 34.89,19.52 35.07,19.7 35.07,24.84 35.31,25.08 U1.6 36.98,25.08 37.18,25.28 37.18,26.07 TP5.TP | v29.38,11.57 30.13,10.81 30.13,10.47 30.7,9.91 U2.1
  Bottom 0.406: v26.99,28.1 27.11,28.1 27.56,27.64 27.63,27.64 | v29.38,11.57 29.08,11.26 27.72,11.26 27.19,10.73 27.19,9.98 27.7,9.47 R19.1 R18.1
  other vias: 12.91,28.57 18.1,32.51 22,27.99
VIN_UC_RAW
  Bottom 0.406: D8.C 11.75,34.65 11.93,34.65 12.84,35.56 C9.1 14.29,35.56 Q2.2 17.85,35.36 AP2112K_3.3V.1 18.37,35.38 18.37,35.88 18.61,36.12 19.49,36.12 19.73,35.88 19.73,35.38 AP2112K_3.3V.3
VIN_USB  (via drill 0.51)
  Top 0.406: v14.18,29 14.18,28.43 14.53,28.08 15.99,28.08 v17.11,29.21 | v9.82,26.49 10.62,26.49 12,27.88 12,30.17 12.91,31.09 R14.1
  Bottom 0.203: D8.A 13.06,32.66 R14.1 | C3.2 12.91,30.26
  Bottom 0.406: D8.A 14.05,33.97 Q2.1 | R14.1 C3.2 12.98,30.48 13.65,30.48 14.18,29.96 v14.18,29 | JP2.VBUS 9.73,26.49 v9.82,26.49
  other vias: 12.91,32.51
XIN32
  Bottom 0.203: U1.1 36.44,27.89 Y1.P$2 36.44,31.19 35.88,31.75 35.88,32.48 C1.2
XOUT32
  Bottom 0.203: U1.2 36.18,27.13 37,27.13 37.18,27.31 37.18,27.83 Y1.P$1 38.67,30.23 37.22,31.67 C2.2
(copper drawn outside any net)
  shapes: Top area x7231